# EAGLE design h_bridge_driver (EAGLE 7.5.0)
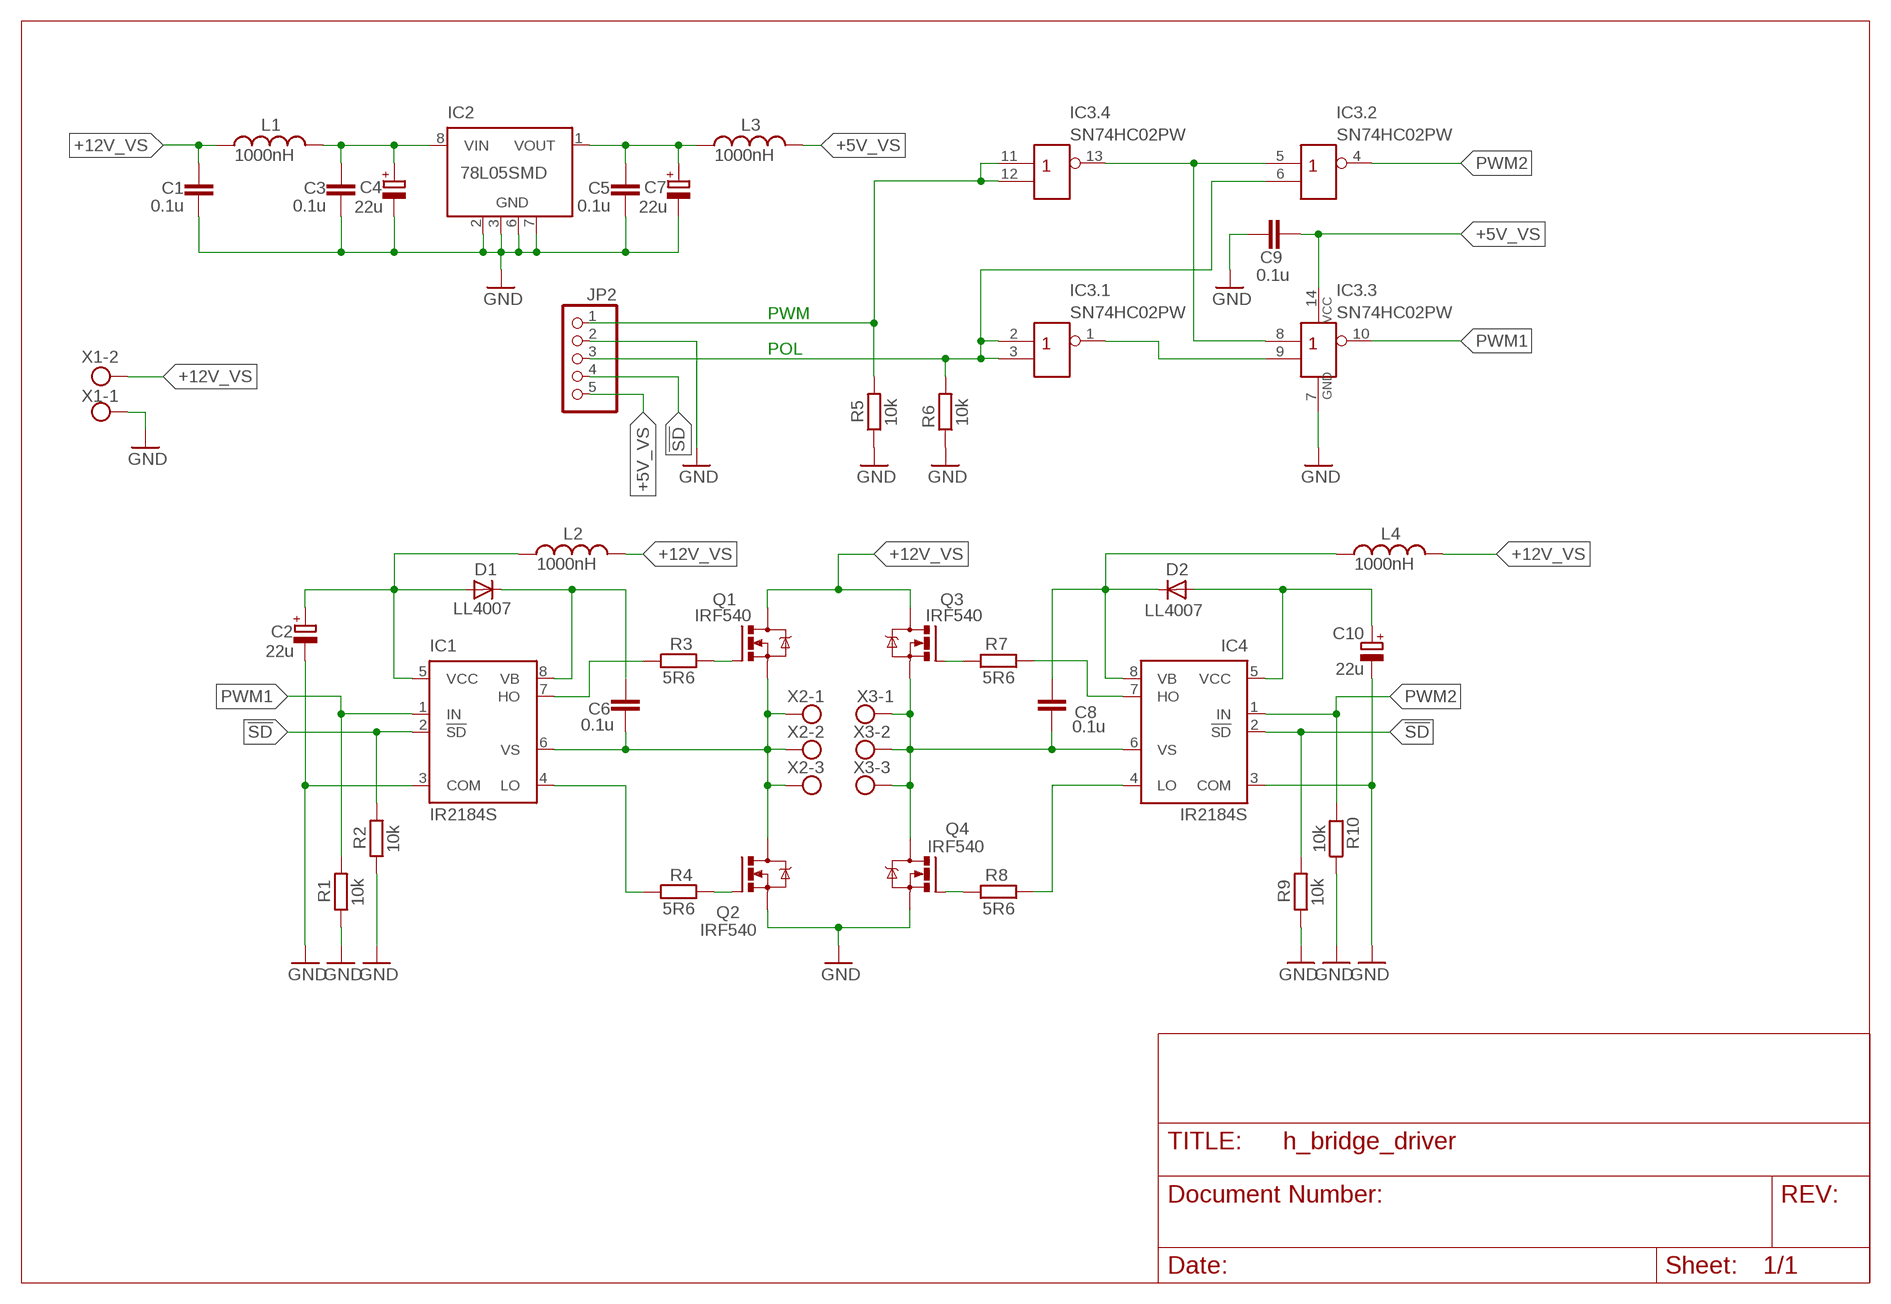
[diagram p0: schematic, sheet 1]

## Parts
C1  0.1u  C-EUC1206  [C1206]
C2  22u  CPOL-EUSMCC  [SMC_C]
C3  0.1u  C-EUC1206  [C1206]
C4  22u  CPOL-EUSMCC  [SMC_C]
C5  0.1u  C-EUC1206  [C1206]
C6  0.1u  C-EUC1206  [C1206]
C7  22u  CPOL-EUSMCC  [SMC_C]
C8  0.1u  C-EUC1206  [C1206]
C9  0.1u  C-EUC1206  [C1206]
C10  22u  CPOL-EUSMCC  [SMC_C]
D1  LL4007  DIODE-MINIMELF  [MINIMELF]
D2  LL4007  DIODE-MINIMELF  [MINIMELF]
IC1  IR2184S  [SO08]
IC2  78L05SMD  [SO08]
IC3  SN74HC02PW  7402D  [SO14]
IC4  IR2184S  [SO08]
JP2  PINHD-1X55X2MM  [1_05X2MM]
L1  1000nH  L-USL1812  [L1812]
L2  1000nH  L-USL1812  [L1812]
L3  1000nH  L-USL1812  [L1812]
L4  1000nH  L-USL1812  [L1812]
Q1  IRF540  [TO220BV]
Q2  IRF540  [TO220BV]
Q3  IRF540  [TO220BV]
Q4  IRF540  [TO220BV]
R1  10k  R-EU_R0603  [R0603]
R2  10k  R-EU_R0603  [R0603]
R3  5R6  R-EU_R0603  [R0603]
R4  5R6  R-EU_R0603  [R0603]
R5  10k  R-EU_R0603  [R0603]
R6  10k  R-EU_R0603  [R0603]
R7  5R6  R-EU_R0603  [R0603]
R8  5R6  R-EU_R0603  [R0603]
R9  10k  R-EU_R0603  [R0603]
R10  10k  R-EU_R0603  [R0603]
X1  MKDSN1,5/2-5,08  [MKDSN1,5/2-5,08]
X2  MKDSN1,5/3-5,08  [MKDSN1,5/3-5,08]
X3  MKDSN1,5/3-5,08  [MKDSN1,5/3-5,08]

## Nets
!SD: IC1.2(!SD) IC4.2(!SD) JP2.4 R2.2 R9.2
+5V_VS: C9.1 IC3.14(P:VCC) JP2.5 L3.2
+12V_VS: C1.1 L1.1 L2.2 L4.2 Q1.D Q3.D X1.2
GND: C1.2 C2.- C3.2 C4.- C5.2 C7.- C9.2 C10.- IC1.3(COM) IC2.2(GND) IC2.3(GND) IC2.6(GND) IC2.7(GND) IC3.7(P:GND) IC4.3(COM) JP2.2 Q2.S Q4.S R1.1 R2.1 R5.1 R6.1 R9.1 R10.1 X1.1
N$1: IC1.7(HO) R3.1
N$2: Q1.G R3.2
N$3: IC1.4(LO) R4.1
N$4: Q2.G R4.2
N$5: C6.1 D1.C IC1.8(VB)
N$6: C6.2 IC1.6(VS) Q1.S Q2.D X2.1 X2.2 X2.3
N$7: Q3.G R7.2
N$8: C2.+ D1.A IC1.5(VCC) L2.1
N$9: IC3.2(.1:I0) IC3.3(.1:I1) IC3.6(.2:I1) JP2.3 R6.2
N$10: IC3.5(.2:I0) IC3.8(.3:I0) IC3.13(.4:O)
N$11: IC3.1(.1:O) IC3.9(.3:I1)
N$12: IC3.11(.4:I0) IC3.12(.4:I1) JP2.1 R5.2
N$13: IC4.7(HO) R7.1
N$14: Q4.G R8.2
N$15: IC4.4(LO) R8.1
N$16: C3.1 C4.+ IC2.8(VIN) L1.2
N$17: C8.1 D2.C IC4.8(VB) L4.1
N$18: C8.2 IC4.6(VS) Q3.S Q4.D X3.1 X3.2 X3.3
N$19: C10.+ D2.A IC4.5(VCC)
N$20: C5.1 C7.+ IC2.1(VOUT) L3.1
PWM1: IC1.1(IN) IC3.10(.3:O) R1.2
PWM2: IC3.4(.2:O) IC4.1(IN) R10.2
Unconnected: IC2.4(NC) IC2.5(NC)

## Notes on the sheet
- PWM
- POL

## Library data of the parts
C1 C3 C5 C6 C8 C9 = rcl:C-EU: CAPACITOR, European symbol
C2 C4 C7 C10 = rcl:CPOL-EU: POLARIZED CAPACITOR, European symbol
D1 D2 = diode:DIODE-: DIODE
IC1 IC4 = IR2184:IR2184: HALF-BRIDGE DRIVER www.irf.com Data Sheet No. PD60174 revG Features *Floating channel designed for bootstrap operation Fully operational to +600V *Tolerant to negative transient voltage dV/dt immune * Gate drive supply range from 10 to 20V * Undervoltage lockout for both channels * 3.3V and 5V input logic compatible * Matched propagation delay for both channels * Logic and power ground +/- 5V offset. * Lower di/dt gate driver for better noise immunity * Output source/sink current capability 1.4A/1.8A * Also available LEAD-FREE (PbF); MF: INTERNATIONAL RECTIFIER(IR); MPN: IR2184
IC2 = linear:78L*SMD: Positive VOLTAGE REGULATOR
IC3 = 74xx-ru:74*02: Quad 2-input NOR gate
JP2 = pinhead:PINHD-1X5: PIN HEADER
L1-L4 = rcl:L-US: INDUCTOR, American symbol
Q1-Q4 = transistor-power:IRF540: HEXFET Power MOSFET
R1-R10 = rcl:R-EU_: RESISTOR, European symbol
X1 = con-phoenix-508:MKDSN1,5/2-5,08: MKDSN 1,5/ 2-5,08 Printklemme Nennstrom: 13,5 A Nennspannung: 250 V Rastermaß: 5,08 mm Polzahl: 2 Anschlussart: Schraubanschluss Montage: Löten Anschlussrichtung Leiter/Platine: 0 ° Artikelnummer: 1729128 Source: http://eshop.phoenixcontact.com .. 1729128.pdf
X2 X3 = con-phoenix-508:MKDSN1,5/3-5,08: MKDSN 1,5/ 3-5,08 Printklemme Nennstrom: 13,5 A Nennspannung: 250 V Rastermaß: 5,08 mm Polzahl: 3 Anschlussart: Schraubanschluss Montage: Löten Anschlussrichtung Leiter/Platine: 0 ° Artikelnummer: 1729131 Source: http://eshop.phoenixcontact.com .. 1729131.pdf

## Board
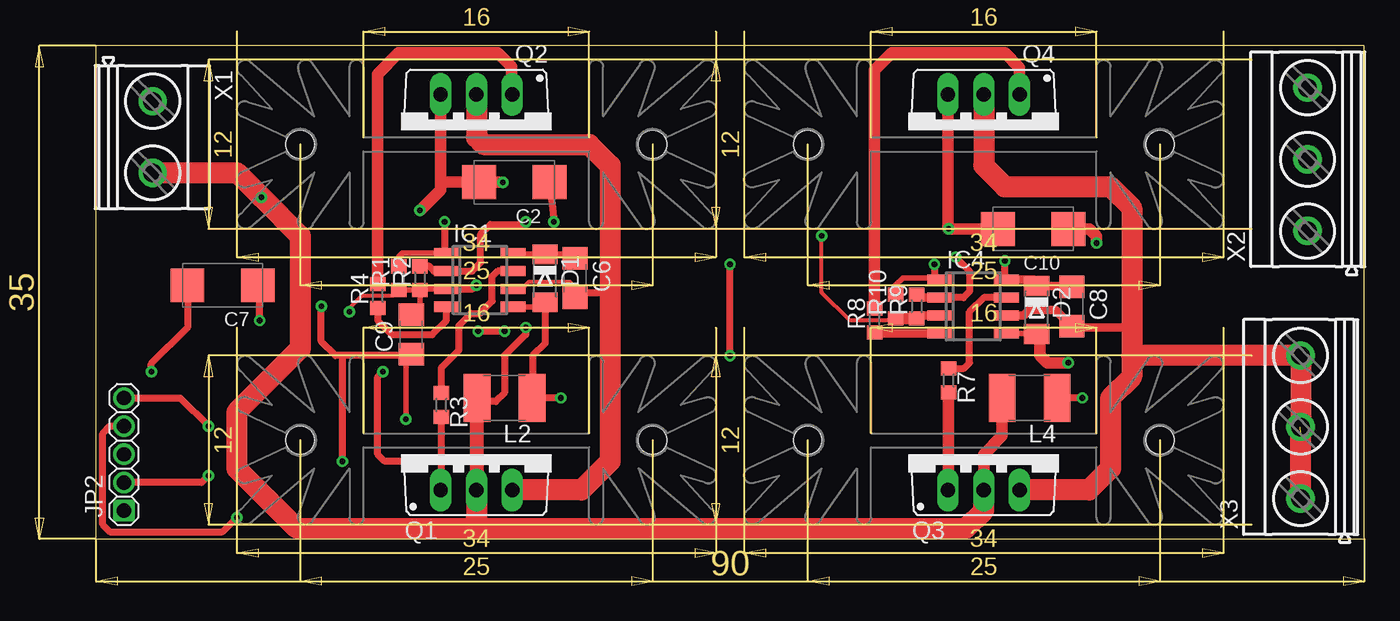
[diagram p1: board, top side]
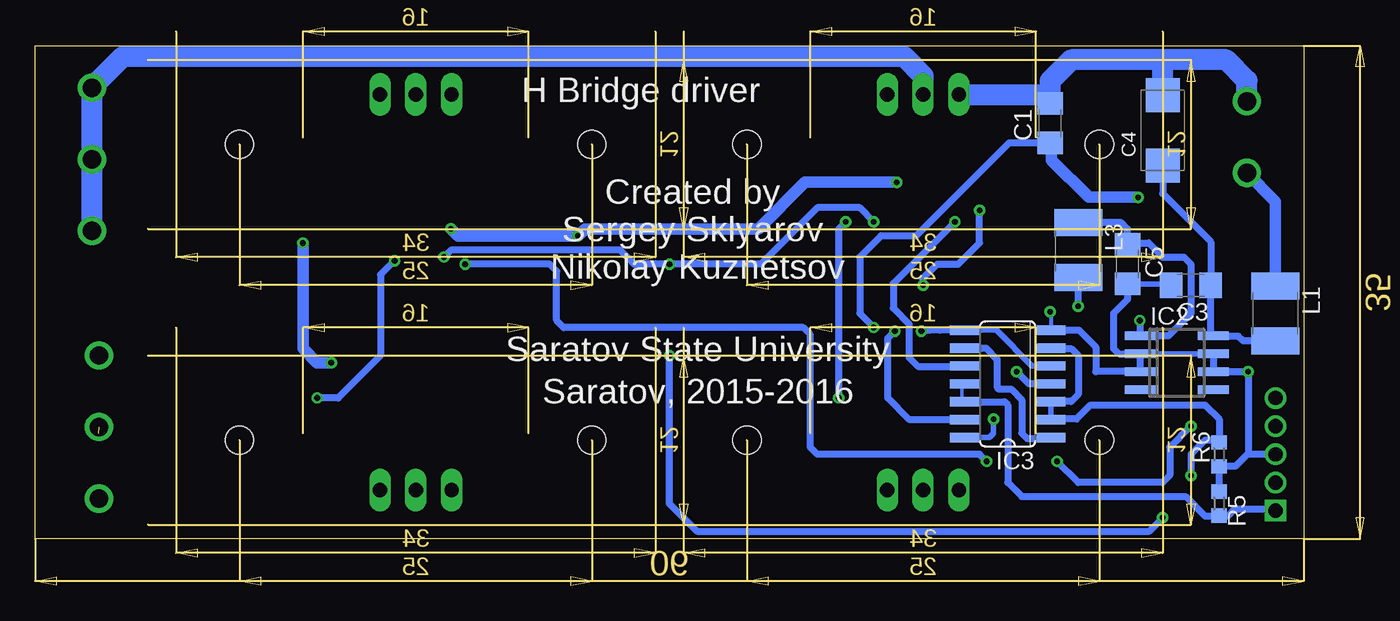
[diagram p2: board, bottom side, seen from below]

Size 90 x 35 mm. Coordinates in mm from the lower left corner, seen from the top.
Outline: 0,0 90,0 90,35 0,35 0,0
Copper layers (1*16): Top 0.035mm / dielectric 1.5mm / Bottom 0.035mm
Design rules "default": minimum track width 10mil, minimum drill 24mil, track to track 8mil, track to pad 8mil, pad to pad 8mil, via to via 8mil, smd to smd 8mil, copper to edge 40mil, drill to drill 8mil, minimum pad ring 10mil, minimum via ring 8mil, stop-mask expansion 4mil, vias tented up to drill 0mil, thermal gap 10mil
Holes 2 mm at 14.5,28 39.5,28 14.5,7 39.5,7 50.5,28 50.5,7 75.5,7 75.5,28

### Footprints (pad centres in the part's own frame; a part is rotated, then mirrored left to right if it is on the bottom)
C1206 = smd 1.6 x 1.8: 1 -1.4,0; 2 1.4,0
SMC_C = smd 2.4 x 2.4: + -2.5,0; - 2.5,0
MINIMELF = smd 1.4 x 1.8: A 1.7,0; C -1.7,0
SO08 = smd 0.72 x 1.78: 1 -1.905,-2.35; 2 -0.635,-2.35; 3 0.635,-2.35; 4 1.905,-2.35; 5 1.905,2.35; 6 0.635,2.35; 7 -0.635,2.35; 8 -1.905,2.35
SO08' = smd 0.6 x 2.2: 1 -1.905,-2.6; 2 -0.635,-2.6; 3 0.635,-2.6; 4 1.905,-2.6; 5 1.905,2.6; 6 0.635,2.6; 7 -0.635,2.6; 8 -1.905,2.6
SO14 = smd 0.66 x 2.032: 1 -3.81,-3.073; 2 -2.54,-3.073; 3 -1.27,-3.073; 4 0,-3.073; 5 1.27,-3.073; 6 2.54,-3.073; 7 3.81,-3.073; 8 3.81,3.073; 9 2.54,3.073; 10 1.27,3.073; 11 0,3.073; 12 -1.27,3.073; 13 -2.54,3.073; 14 -3.81,3.073
1_05X2MM = drill 1.016 pad 1.3 square: 1 -4,0 | drill 1.016 pad 1.3: 2 0,0; 3 -2,0; 4 2,0; 5 4,0
L1812 = smd 1.9 x 3.4: 1 -1.95,0; 2 1.95,0
TO220BV = drill 1.016 long: D 0,-2.54; G -2.54,-2.54; S 2.54,-2.54
R0603 = smd 1 x 1.1: 1 -0.85,0; 2 0.85,0
MKDSN1,5/2-5,08 = drill 1.3 pad 2: 1 -2.561,0.025; 2 2.519,0.025
MKDSN1,5/3-5,08 = drill 1.3 pad 2: 1 -7.641,0.025; 2 -2.561,0.025; 3 2.519,0.025

### Placement (x,y rotation side)
C1  18,29.5 90 bottom
C2  29.69,25.31 180 top
C3  8,18 180 bottom
C4  10,29 90 bottom
C5  12.5,19.5 270 bottom
C6  34,18.5 270 top
C7  9,18 180 top
C8  69.25,16.5 270 top
C9  22.38,14.5 90 top
C10  66.5,22 180 top
D1  31.88,18.5 270 top
D2  66.75,16.25 270 top
IC1  27.25,18.38 270 top
IC2  78L05SMD  [SO08']  9,12.5 270 bottom
IC3  21,11 90 bottom
IC4  62.25,16.5 270 top
JP2  2,6 90 top
L1  2,16 270 bottom
L2  29,10 180 top
L3  16,20.5 270 bottom
L4  66.25,10 180 top
Q1  27,6 0 top
Q2  27,29 180 top
Q3  63,6 0 top
Q4  63,29 180 top
R1  21.5,18.5 90 top
R2  23,18.5 90 top
R3  24.5,9.5 270 top
R4  20,17.25 90 top
R5  6,2.5 270 bottom
R6  6,6 90 bottom
R7  60.5,11.25 270 top
R8  55.25,15.5 90 top
R9  58.25,16.5 90 top
R10  56.75,16.5 90 top
U$1  [BLA024]  27,7 0 top
U$2  [BLA024]  63,7 0 top
U$3  [BLA024]  27,28 0 top
U$4  [BLA024]  63,28 0 top
X1  4,28.5 270 top
X2  86,29.5 90 top
X3  85.5,10.5 90 top

### Tracks (layer width: path | path; a pad name or v marks a point on that pad's centre or on a via)
!SD  (via drill 0.4)
  Top 0.5: R2.2 23.65,19.35 24,19 IC1.2 26.7,19.01 27.31,19.62 27.31,21.62 28,22.31 30.31,22.31 v30.5,22.5 | v61,20 62,19 62,17.56 61.56,17.12 59.91,17.12 IC4.2 | v10,1.5 9,0.5 1,0.5 0.5,1 0.5,7.5 1,8 JP2.4 | v45,13 v45,19.5
  Top 0.6: IC4.2 58.47,17.14 arc-90 R9.2
  Bottom 0.5: v30.5,22.5 31.5,23.5 34.5,23.5 38.5,19.5 v45,19.5 47.5,19.5 48.5,20.5 60.5,20.5 v61,20 | v10,1.5 11,0.5 43,0.5 45,2.5 v45,13
+5V_VS  (via drill 0.4)
  Top 0.4: C9.1 22,12.72 v22,8.5
  Top 0.5: 22,12.72 21.73,13 17.5,13 | 17.5,13 17,13 16,14 v16,16.5 | v17.5,5.5 17.5,13 | JP2.5 6,10 v8,8
  Bottom 0.4: v22,8.5 22,7.5 22.31,7.19 IC3.14
  Bottom 0.5: v16,16.5 L3.2 | v8,8 9.5,6.5 9.5,4.5 10,4 16,4 v17.5,5.5
+12V_VS  (via drill 0.4)
  Top 0.5: v30.5,15 30.5,14.5 29,13 29,10.38 28.38,9.75 27.3,9.75 L2.2
  Top 0.8: Q3.D 63,6 64.3,7.3 L4.2
  Top 1: L2.2 27,9.95 Q1.D
  Top 1.5: Q1.D 27,1.5 | Q3.D 63,2 61.75,0.75 14.25,0.75 10,5 10,9 14.5,13.5 14.5,21.5 v11.75,24.25 10.02,25.98 X1.2
  Bottom 0.5: v30.5,15 31.5,16 31.5,20 30,21.5 27.5,21.5 20.9,28.1 C1.1
  Bottom 0.8: L1.1 2,23.96 X1.2 | C1.1 17.9,28 17.9,26.9 15.25,24.25 v11.75,24.25
GND  (via drill 0.4)
  Top 0.3: R1.1 21.1,17.25 18.88,17.25 18,16.38 v18,16.12 | R10.1 56.6,15.5 53.5,15.5 51.5,17.5 v51.5,21.5
  Top 0.4: R1.1 R2.1 | R2.1 23.09,17.74 IC1.3 | R2.1 23,16.5 22.4,15.9 C9.2
  Top 0.5: IC1.3 26.74,17.74 v27,18 | C7.- 6.5,15 3.94,12.44 v3.94,11.86
  Top 0.6: IC4.3 58.47,15.87 R9.1
  Top 0.8: v28.88,25.31 C2.- 24.65,25.31 24.46,25.5 | R10.1 R9.1 | Q4.S 60.46,22.04 v60.5,22 C10.- | Q2.S 24.46,25.5 | 24.46,25.5 24.46,24.77 v23,23.31
  Bottom 0.3: v18,16.12 17.93,16.05 IC3.7
  Bottom 0.4: IC2.7 IC2.2 | C5.2 9.5,18.1 C3.2
  Bottom 0.5: R5.1 R6.1 4.85,5.15 3.94,6.06 | IC2.7 IC2.6 v3.94,11.87 v3.94,11.86 3.94,6.06 | IC3.7 15.94,14.81 14.75,13.62 14.75,11.88 14.74,11.87 IC2.3 IC2.2 13.12,13.12 13.5,13.5 13.5,16 12.5,17 C5.2 | C1.2 18,31.54 | v27,18 27,18.5 26,19.5 24.5,19.5 23,21 v23,23.31 | JP2.2 3.88,6 3.94,6.06
  Bottom 0.8: v28.88,25.31 35.38,25.31 38.69,22 51,22 v51.5,21.5 60,21.5 v60.5,22
  Bottom 1.5: Q2.S 18,31.54 | 10.04,31.54 C4.- 10,34 | X1.1 4.03,32.52 5.5,34 10,34 | 10,34 16.5,34 18,32.5 C1.2
N$1
  Top 0.5: IC1.7 28.51,19.01 28.12,18.62 28.12,16.88 27.25,16 26.62,16 25.75,15.12 25.75,13.38 24.5,12.12 R3.1
N$2
  Top 0.5: R3.2 24.5,3.5 Q1.G
N$3
  Top 0.5: R4.1 20,15.5 21,14.5 23.88,14.5 24.88,15.5 24.88,16.45 IC1.4
N$4
  Top 0.8: R4.2 20,33 21.5,34.5 28.5,34.5 29.5,33.5 29.5,31.58 Q2.G
N$5
  Top 0.4: IC1.8 29.68,20.2 D1.C 33.7,20.2 C6.1
N$6
  Top 0.3: IC1.6 30.24,17.74 30.75,18.25 33.62,18.25 33.88,18 33.88,17.23 C6.2
  Top 0.4: 34.1,17 C6.2 34,17.5
  Top 0.5: 34,17.5 36,17.5 36.5,17
  Top 1.5: Q1.S 34.46,3.46 36.5,5.5 36.5,17 36.5,26.5 35,28 27.5,28 27,28.5 Q2.D
  Bottom 1.5: Q2.D 27,32.88 28.38,34.25 83.74,34.25 X2.3 X2.2 X2.1
N$7
  Top 0.8: R7.2 60.5,3.5 Q3.G
N$8  (via drill 0.4)
  Top 0.4: D1.A 31.55,16.47 IC1.5
  Top 0.5: C2.+ v32.5,22.5 | v33,10 L2.1 31,10.05 31,13 31.88,13.88 D1.A
  Bottom 0.5: v32.5,22.5 33,22 v33,10
N$9  (via drill 0.4)
  Top 0.5: v8,4.5 7.5,4 JP2.3
  Bottom 0.4: IC3.2 IC3.3 | 17.89,13.5 IC3.6
  Bottom 0.5: 17.89,13.5 16.5,13.5 16,13 16,10.25 16.5,9.75 17.91,9.75 IC3.3 | IC3.2 17.89,8.5 16.12,8.5 15.12,9.5 7,9.5 6,8.5 R6.2 6.15,7 7,7 8,6 v8,4.5
N$10  (via drill 0.4)
  Top 0.5: v27.12,14.75 v29,14.75
  Bottom 0.4: IC3.8 21.81,14.81 19.27,12.27 IC3.5 | IC3.13 24.11,8.5
  Bottom 0.5: IC3.13 27.96,8.46 29.5,10 29.5,14.25 v29,14.75 | IC3.8 25.82,14.81 v27.12,14.75
N$11
  Bottom 0.5: IC3.9 22.54,13.54 21.75,12.75 21.75,10.75 21.62,10.62 20.75,10.62 20,9.88 20,7.5 19.62,7.12 17.99,7.12 IC3.1
N$12
  Bottom 0.254: IC3.12 24.25,9.75 24.25,11 IC3.11
  Bottom 0.5: IC3.12 21.23,9.73 21,9.5 21,4 20,3 8.38,3 7,1.62 6.03,1.62 R5.2 5.35,1.65 4.88,2.12 2.12,2.12 JP2.1
N$13
  Top 0.5: IC4.7 64.59,17.12 63,17.12 62,16.12 62,12.5 61.6,12.1 R7.1
N$14
  Top 0.8: Q4.G 65.54,33.46 64.5,34.5 56.5,34.5 55.25,33.25 R8.2
N$15
  Top 0.6: IC4.4 55.3,14.6 R8.1
N$16
  Bottom 0.5: L1.2 4.3,14.05 4.62,14.38 6.37,14.38 IC2.8 6.6,14.61 C3.1 6.6,21.1 10,24.5 C4.+
N$17  (via drill 0.4)
  Top 0.5: IC4.8 64.5,18.5 v64.5,19.75 | v70,10 L4.1
  Top 0.6: C8.1 69.2,17.95 D2.C 66.55,18.41 IC4.8
  Bottom 0.5: v64.5,19.75 65.5,18.75 65.5,13 68.5,10 v70,10
N$18  (1 unrouted)
  Top 0.254: 69.25,15.25 C8.2
  Top 0.6: 73.5,15 69.35,15 C8.2 68.1,16.25 66.25,16.25 65.86,15.87 IC4.6
  Top 1.5: Q4.D 63,26.5 64.5,25 72,25 73.5,23.5 73.5,15 73.5,13 | 73.5,13 73.5,11.5 72,10 72,5 70.46,3.46 Q3.S | X3.3 85.46,13 | 85.46,13 73.5,13 | 85.46,13 85.5,12.96 85.5,7.5 85.47,7.47 X3.1
N$19  (via drill 0.4)
  Top 0.4: D2.A 66.7,14.6 IC4.5
  Top 0.8: v69,12.5 67.5,12.5 67,13 67,14.3 D2.A | C10.+ 70.5,22 71,21.5 v71,21
  Bottom 0.8: v71,21 71,13.5 70,12.5 v69,12.5
N$20  (via drill 0.4)
  Top 0.5: v11.62,15.5 11.62,17.88 C7.+
  Bottom 0.5: L3.1 12.95,22.45 12.5,22 C5.1 12.4,21 11,21 10,20 8.5,20 8,19.5 8,16 9.6,14.4 IC2.1 11.6,15.47 v11.62,15.5
PWM1  (via drill 0.4)
  Top 0.4: R1.2 21.5,20 21.78,20.28 IC1.1
  Top 0.5: v24.75,22.5 24.75,20.43 IC1.1
  Bottom 0.5: v24.75,22.5 29.12,18.12 29.12,16.38 28,15.25 28,12.88 27.38,12.25 24.09,12.25 IC3.10
PWM2  (via drill 0.4)
  Top 0.4: IC4.1 59.8,18.5 59.38,18.5 57.25,18.5 56.75,18 R10.2
  Top 0.5: v59.5,19.5 59.5,18.62 59.38,18.5 | v22.5,5.5 20.5,5.5 20,6 20,11.5 v20.38,11.88
  Bottom 0.5: IC3.4 19.5,11 v20.38,11.88 | v59.5,19.5 53.5,19.5 53,19 53,15.5 52.5,15 35.5,15 35,14.5 35,6.5 34.5,6 23,6 v22.5,5.5

### Text on the board
bPlace: H Bridge driver | Created by / Sergey Sklyarov / Nikolay Kuznetsov | Saratov State University | Saratov, 2015-2016
Text: Sergey Sklyarov / Nikolai Kuznetsov / Saratov State / University, 2015